# Altium project PCB_Project1.PrjPCB (part 2 of 2)

## Sheet Sheet7.SchDoc
size A4
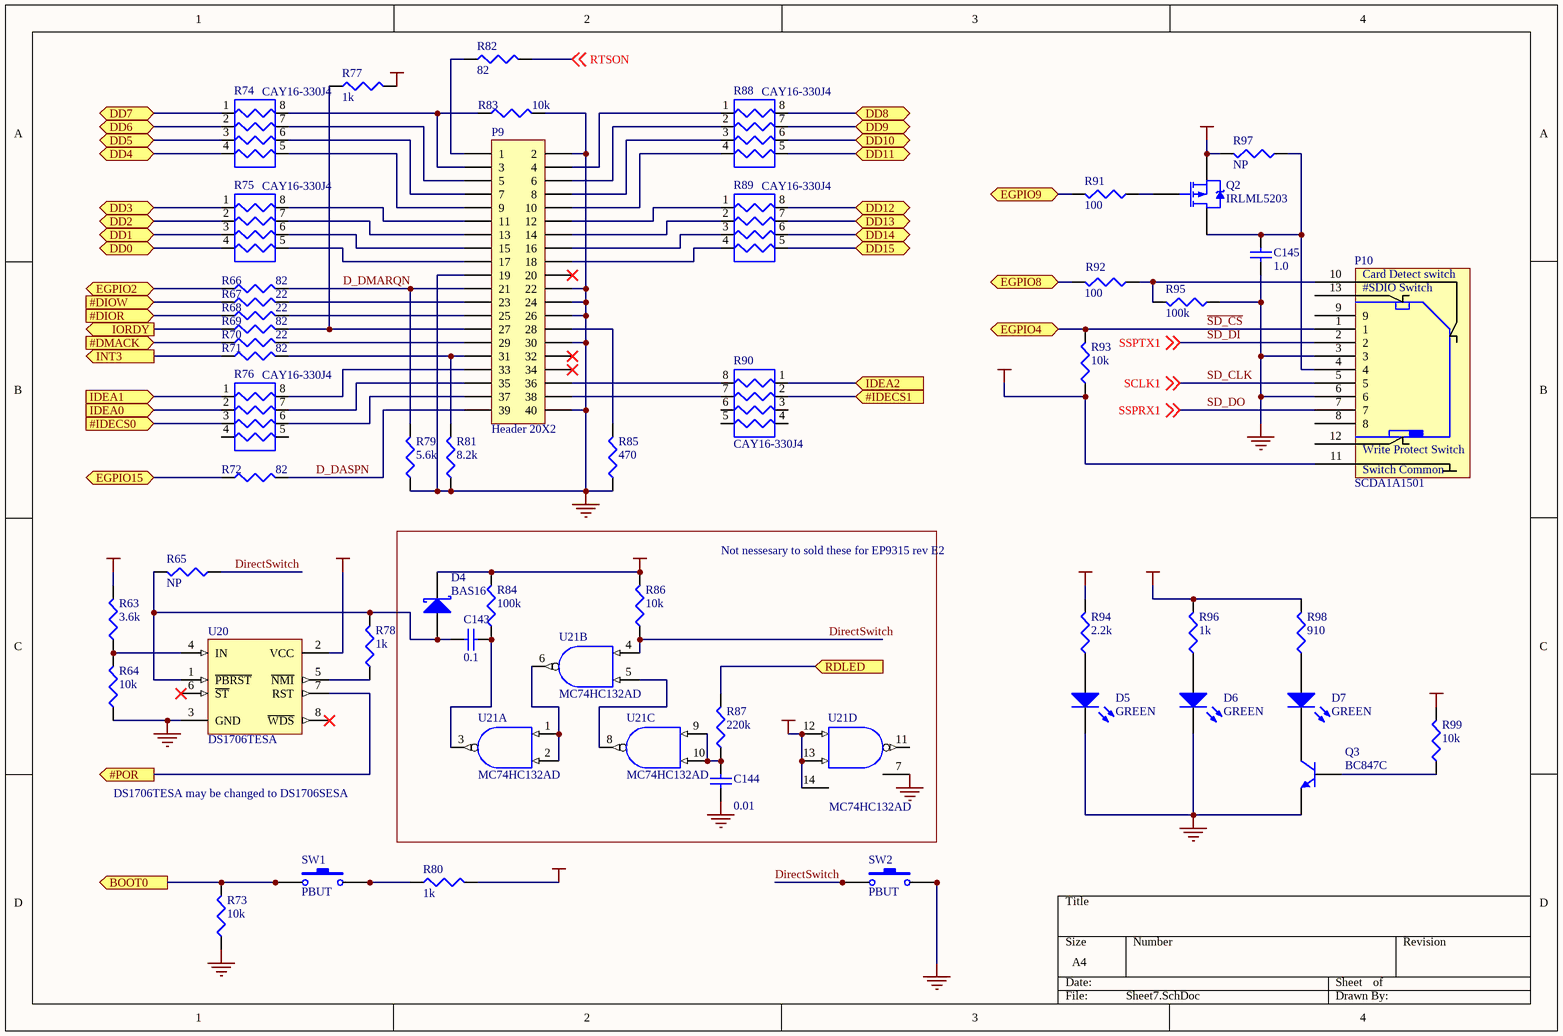
[diagram p6: Sheet7.SchDoc]

### Parts
C143  0.1  [0603]
C144  0.01  [0603]
C145  1.0  [0603]
D4  BAS16  [SOT23]
D5  GREEN  [DSO-F2/D6.1]
D6  GREEN  [DSO-F2/D6.1]
D7  GREEN  [DSO-F2/D6.1]
P9  Header 20X2  [HDR2X20]
P10  SCDA1A1501  [SCDA_NO2]
Q2  IRLML5203  [SOT-23]
Q3  BC847C  [SOT23]
R63  3.6k  [CR1608-0603]
R64  10k  [CR1608-0603]
R65  NP  [CR1608-0603]
R66  82  [CR1608-0603]
R67  22  [CR1608-0603]
R68  22  [CR1608-0603]
R69  82  [CR1608-0603]
R70  22  [CR1608-0603]
R71  82  [CR1608-0603]
R72  82  [CR1608-0603]
R73  10k  [CR1608-0603]
R74  CAY16-330J4  [CAY16-J4]
R75  CAY16-330J4  [CAY16-J4]
R76  CAY16-330J4  [CAY16-J4]
R77  1k  [CR1608-0603]
R78  1k  [CR1608-0603]
R79  5.6k  [CR1608-0603]
R80  1k  [CR1608-0603]
R81  8.2k  [CR1608-0603]
R82  82  [CR1608-0603]
R83  10k  [CR1608-0603]
R84  100k  [CR1608-0603]
R85  470  [CR1608-0603]
R86  10k  [CR1608-0603]
R87  220k  [CR1608-0603]
R88  CAY16-330J4  [CAY16-J4]
R89  CAY16-330J4  [CAY16-J4]
R90  CAY16-330J4  [CAY16-J4]
R91  100  [CR1608-0603]
R92  100  [CR1608-0603]
R93  10k  [CR1608-0603]
R94  2.2k  [CR1608-0603]
R95  100k  [CR1608-0603]
R96  1k  [CR1608-0603]
R97  NP  [CR1608-0603]
R98  910  [CR1608-0603]
R99  10k  [CR1608-0603]
SW1  PBUT  [SWBUTDIP4]
SW2  PBUT  [SWBUTDIP4]
U20  DS1706TESA  [SOIC8N]
U21  MC74HC132AD  [751A-03]  (parts A,B,C,D of 4)

### Blocks framed on the sheet
Not nessesary to sold these for EP9315 rev E2: C143 C144 D4 R84 R86 R87 U21

### Ports
#DIOR (in), #DIOW (in), #DMACK (in), #IDECS0 (in), #IDECS1 (in), #POR (out), BOOT0 (out), DD0 (bidir), DD1 (bidir), DD2 (bidir), DD3 (bidir), DD4 (bidir), DD5 (bidir), DD6 (bidir), DD7 (bidir), DD8 (bidir), DD9 (bidir), DD10 (bidir), DD11 (bidir), DD12 (bidir), DD13 (bidir), DD14 (bidir), DD15 (bidir), EGPIO2 (bidir), EGPIO4 (bidir), EGPIO8 (bidir), EGPIO9 (bidir), EGPIO15 (bidir), IDEA0 (in), IDEA1 (in), IDEA2 (in), INT3 (out), IORDY (out), RDLED (in)

### Nets
GND: C144.1 C145.1 D5.2(K) D6.2(K) P9.2 P9.19 P9.22 P9.24 P9.26 P9.30 P9.40 P10.3 P10.6 Q3.2(E) R64.1 R73.1 R79.1 R81.1 R83.2 R85.1 R95.1 SW2.2 SW2.3 U20.3(GND) U21.7(GND)
VCC5V0: R94.2
VCCCORE: R63.2 R99.2
VCCIO: D4.3(K) P10.11(common) Q2.2(S) R77.2 R80.2 R84.2 R86.2 R93.1 R96.2 R97.2 R98.2 U20.2(VCC) U21.12(A) U21.13(B) U21.14(VDD)  [also labelled VDD]
#POR: U20.7(RST) ; port #POR
BOOT0: R73.2 SW1.1 SW1.4 ; port BOOT0
D_DASPN: P9.39 R72.2
D_DMARQN: P9.21 R66.2 R79.2
DirectSwitch: R65.1 R86.1 SW2.1 SW2.4 U21.4(A)
INT3: R71.1 ; port INT3
RDLED: R87.2 ; port RDLED
RTSON: R82.2 ; off-sheet RTSON
~{SD_CS}: P10.1 R93.2 ; port EGPIO4
SCLK1: P10.5 ; off-sheet SCLK1  [also labelled SD_CLK]
SD_DI: P10.2 ; off-sheet SSPTX1  [also labelled SSPTX1]
SD_DO: P10.7 ; off-sheet SSPRX1  [also labelled SSPRX1]
NetC143_1: C143.1 R84.1 U21.3(Y)
NetC143_2: C143.2 D4.1(A) R65.2 R78.2 U20.1(~{PBRST})
NetC144_2: C144.2 R87.1 U21.9(A) U21.10(B)
NetC145_2: C145.2 P10.4 Q2.3(D) R97.1
NetD5_1: D5.1(A) R94.1
NetD6_1: D6.1(A) R96.1
NetD7_1: D7.1(A) R98.1
NetD7_2: D7.2(K) Q3.3(C)
NetP9_1: P9.1 R82.1
NetP9_3: P9.3 R74.8 R83.1
NetP9_4: P9.4 R88.1
NetP9_5: P9.5 R74.7
NetP9_6: P9.6 R88.2
NetP9_7: P9.7 R74.6
NetP9_8: P9.8 R88.3
NetP9_9: P9.9 R74.5
NetP9_10: P9.10 R88.4
NetP9_11: P9.11 R75.8
NetP9_12: P9.12 R89.1
NetP9_13: P9.13 R75.7
NetP9_14: P9.14 R89.2
NetP9_15: P9.15 R75.6
NetP9_16: P9.16 R89.3
NetP9_17: P9.17 R75.5
NetP9_18: P9.18 R89.4
NetP9_23: P9.23 R67.2
NetP9_25: P9.25 R68.2
NetP9_27: P9.27 R69.2 R77.1
NetP9_28: P9.28 R85.2
NetP9_29: P9.29 R70.2
NetP9_31: P9.31 R71.2 R81.2
NetP9_33: P9.33 R76.8
NetP9_35: P9.35 R76.7
NetP9_36: P9.36 R90.8
NetP9_37: P9.37 R76.6
NetP9_38: P9.38 R90.7
NetP10_10: P10.10(CDETECT) R92.1 R95.2
NetQ2_1: Q2.1(G) R91.1
NetQ3_1: Q3.1(B) R99.1
NetR63_1: R63.1 R64.2 U20.4(IN)
NetR66_1: R66.1 ; port EGPIO2
NetR67_1: R67.1 ; port #DIOW
NetR68_1: R68.1 ; port #DIOR
NetR69_1: R69.1 ; port IORDY
NetR70_1: R70.1 ; port #DMACK
NetR72_1: R72.1 ; port EGPIO15
NetR74_1: R74.1 ; port DD7
NetR74_2: R74.2 ; port DD6
NetR74_3: R74.3 ; port DD5
NetR74_4: R74.4 ; port DD4
NetR75_1: R75.1 ; port DD3
NetR75_2: R75.2 ; port DD2
NetR75_3: R75.3 ; port DD1
NetR75_4: R75.4 ; port DD0
NetR76_1: R76.1 ; port IDEA1
NetR76_2: R76.2 ; port IDEA0
NetR76_3: R76.3 ; port #IDECS0
NetR78_1: R78.1 U20.5(~{NMI})
NetR80_1: R80.1 SW1.2 SW1.3
NetR88_5: R88.5 ; port DD11
NetR88_6: R88.6 ; port DD10
NetR88_7: R88.7 ; port DD9
NetR88_8: R88.8 ; port DD8
NetR89_5: R89.5 ; port DD15
NetR89_6: R89.6 ; port DD14
NetR89_7: R89.7 ; port DD13
NetR89_8: R89.8 ; port DD12
NetR90_1: R90.1 ; port IDEA2
NetR90_2: R90.2 ; port #IDECS1
NetR91_2: R91.2 ; port EGPIO9
NetR92_2: R92.2 ; port EGPIO8
NetU21_1: U21.1(A) U21.2(B) U21.6(Y)
NetU21_5: U21.5(B) U21.8(Y)

Not connected (* = marked no-connect by the designer): P9 20* 32* 34*; P10 8 9 12(WP) 13(SDIO); R76 4 5; R90 3 4 5 6; U20 6(~{ST})* 8(~{WDS})*; U21 11(Y)

### Notes on the sheet
- DS1706TESA may be changed to DS1706SESA
- (in symbol SCDA1A1501) Card Detect switch; #SDIO Switch; Write Protect Switch; Switch Common

### Library data of the parts
C143-C145 = C0603: as C1 on sheet Sheet1; Published: 17-Jul-2002; LatestRevisionDate: 19-Mar-2004; LatestRevisionNote: Silkscreen size reduced.; DatasheetDocument: Mar-2001; PackageDocument: Mar-2001; PackageReference: 0603; Publisher: Altium Limited; Code_JEITA: 0603; Code_IPC: 1608 [0603]; ComponentLink1Description: Manufacturer Link; ComponentLink1URL: http://www.kemet.com/; ComponentLink2Description: Datasheet; ComponentLink2URL: http://www.kemet.com/kemet/web/homepage/kechome.nsf/vapubfilesname/F3102TA.pdf/$file/F3102TA.pdf
  C143: Value: 0.1
  C144: Value: 0.01
  C145: Value: 1.0
D4 = BAS40: Schottky Barrier Diode; Note: Pin 2 is not connected and is not drawn; Published: 17-Sep-2003; DatasheetDocument: 10-Feb-2001; PackageDocument: May-1999; PackageReference: SOT23; Publisher: Altium Limited; ComponentLink1Description: Manufacturer Link; ComponentLink1URL: http://www.semiconductors.philips.com/; ComponentLink2Description: Datasheet; ComponentLink2URL: http://www.semiconductors.philips.com/acrobat/datasheets/BAS40_SERIES_5.pdf
D5-D7 = LED2: Typical RED, GREEN, YELLOW, AMBER GaAs LED; Published: 8-Jun-2000; Revision: July-2002: Re-released for DXP Platform.; Publisher: Altium Limited
P9 = Header 20X2: Header, 20-Pin, Dual row; LatestRevisionDate: 17-Jul-2002; LatestRevisionNote: Re-released for DXP Platform.; Publisher: Altium Limited
P10 = SCDA1A1501: Connector for SD Memory Card
Q2 = IRLML5103: HEXFET Power MOSFET; Published: 8-Jun-2000; LatestRevisionDate: 17-Jul-2002; LatestRevisionNote: Re-released for DXP Platform.; DatasheetDocument: Aug-1997; PackageReference: SOT-23; Publisher: Altium Limited; ComponentLink1Description: Manufacturer Link; ComponentLink1URL: http://www.irf.com/
Q3 = BC847C: NPN General-purpose Transistor; Published: 17-Sep-2003; DatasheetDocument: 4-Feb-2002; PackageDocument: May-1999; PackageReference: SOT23; Publisher: Altium Limited; ComponentLink1Description: Manufacturer Link; ComponentLink1URL: http://www.semiconductors.philips.com/; ComponentLink2Description: Datasheet; ComponentLink2URL: http://www.semiconductors.philips.com/acrobat/datasheets/BC846_BC847_BC848_5.pdf
R63-R73 R77-R87 R91-R99 = Res3: Resistor; Published: 8-Jun-2000; Revision: July-2002: Re-released for DXP Platform.; Publisher: Altium Limited
  R63: Value: 3.6k
  R64 R73 R83 R86 R93 R99: Value: 10k
  R65 R97: Value: NP
  R66 R69 R71 R72 R82: Value: 82
  R67 R68 R70: Value: 22
  R77 R78 R80 R96: Value: 1k
  R79: Value: 5.6k
  R81: Value: 8.2k
  R84 R95: Value: 100k
  R85: Value: 470
  R87: Value: 220k
  R91 R92: Value: 100
  R94: Value: 2.2k
  R98: Value: 910
R74-R76 R88-R90 = CAY16-J4: Chip Resistor Arrays
SW1 SW2 = PBUT: DIP4 PushButton
U20 = DS1706LESA: 3.3 and 5.0 Volt MicroMonitor; PackageDocument: 1999; Published: 13-Oct-2000; LatestRevisionDate: 4-Mar-2005; LatestRevisionNote: Stylized 3D Model Added.; DatasheetDocument: 4-Sep-1998; PackageReference: SOIC8N; Publisher: Altium Limited; ComponentLink1Description: Manufacturer Link; ComponentLink1URL: http://www.maxim-ic.com/
U21 = MC74HC132AD: Quad 2-Input NAND Gate with Schmitt Trigger Inputs; Published: 15-Apr-2002; DatasheetDocument: Mar-2000; PackageReference: 751A-03; Publisher: Altium Limited; Code_JEDEC: MS-012-AB; Code_IPC: SO14; ComponentLink1Description: Manufacturer Link; ComponentLink1URL: http://www.onsemi.com/

## Sheet Sheet8.SchDoc
size A4
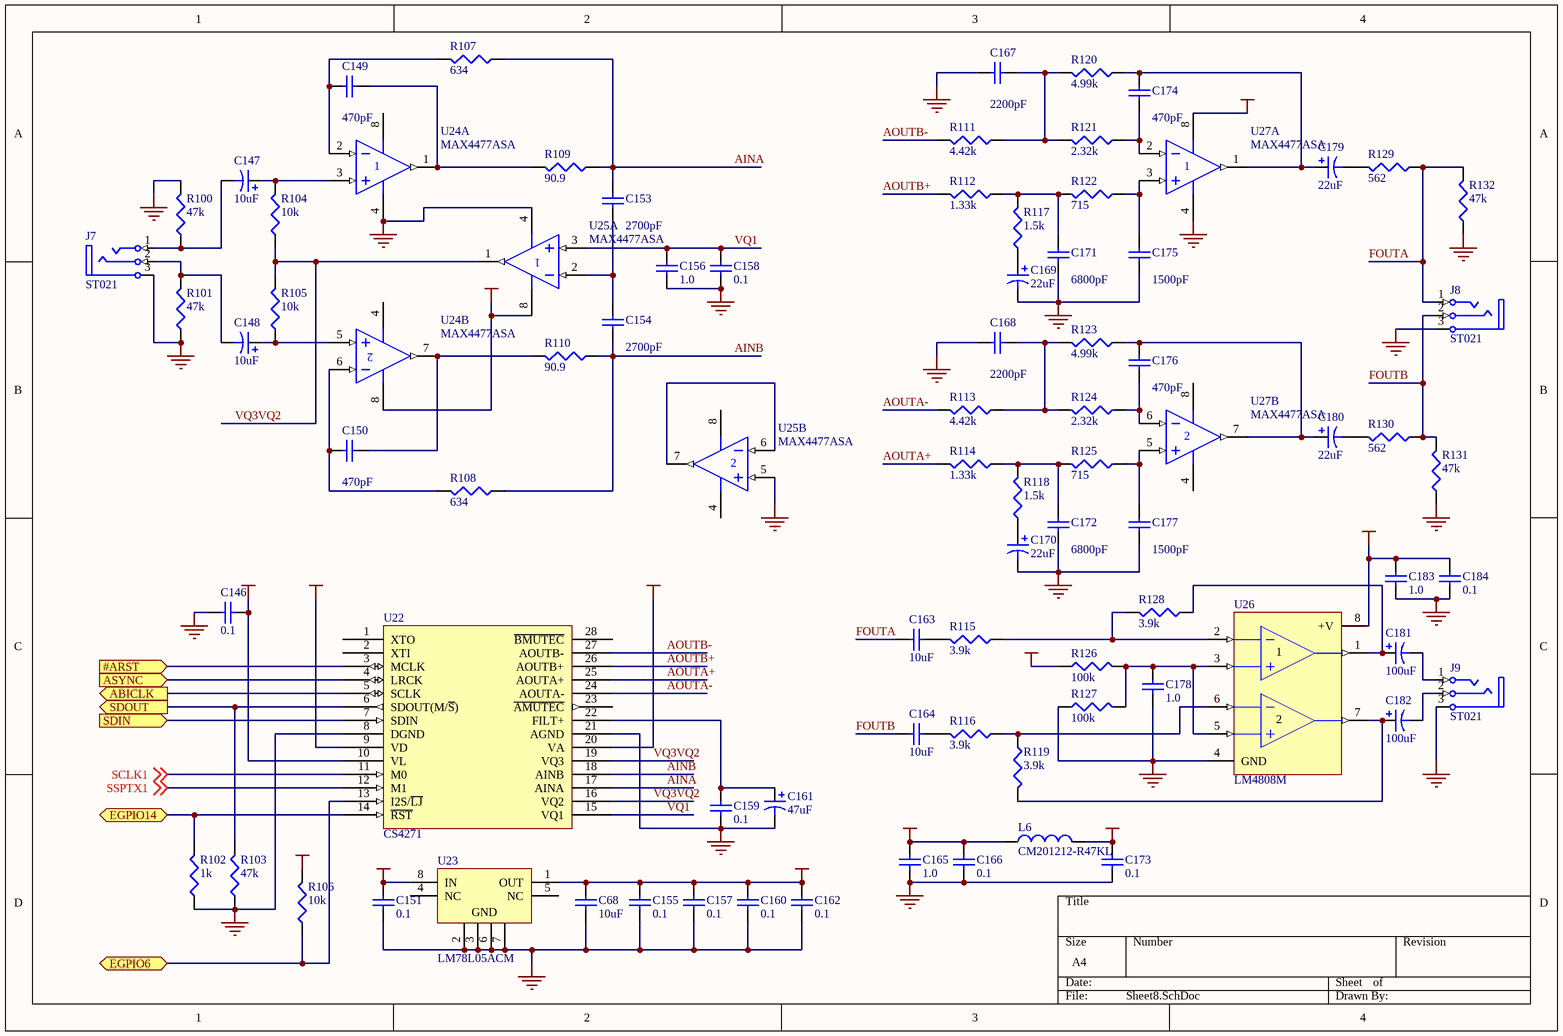
[diagram p7: Sheet8.SchDoc]

### Parts
C68  10uF  [1206]
C146  0.1  [0603]
C147  10uF  [CAPPR1.5-4x5]
C148  10uF  [CAPPR1.5-4x5]
C149  470pF  [0603]
C150  470pF  [0603]
C151  0.1  [0603]
C153  2700pF  [0603]
C154  2700pF  [0603]
C155  0.1  [0603]
C156  1.0  [0603]
C157  0.1  [0603]
C158  0.1  [0603]
C159  0.1  [0603]
C160  0.1  [0603]
C161  47uF  [CAPPR1.5-4x5]
C162  0.1  [0603]
C163  10uF  [1206]
C164  10uF  [1206]
C165  1.0  [0603]
C166  0.1  [0603]
C167  2200pF  [0603]
C168  2200pF  [0603]
C169  22uF  [CAPPR1.5-4x5]
C170  22uF  [CAPPR1.5-4x5]
C171  6800pF  [0603]
C172  6800pF  [0603]
C173  0.1  [0603]
C174  470pF  [0603]
C175  1500pF  [0603]
C176  470pF  [0603]
C177  1500pF  [0603]
C178  1.0  [0603]
C179  22uF  [CAPPR1.5-4x5]
C180  22uF  [CAPPR1.5-4x5]
C181  100uF  [CAPPR1.5-4x5]
C182  100uF  [CAPPR1.5-4x5]
C183  1.0  [0603]
C184  0.1  [0603]
J7  ST021  [ST023]
J8  ST021  [ST023]
J9  ST021  [ST023]
L6  CM201212-R47KL  [INDC2012-0805]
R100  47k  [CR1608-0603]
R101  47k  [CR1608-0603]
R102  1k  [CR1608-0603]
R103  47k  [CR1608-0603]
R104  10k  [CR1608-0603]
R105  10k  [CR1608-0603]
R106  10k  [CR1608-0603]
R107  634  [CR1608-0603]
R108  634  [CR1608-0603]
R109  90.9  [CR1608-0603]
R110  90.9  [CR1608-0603]
R111  4.42k  [CR1608-0603]
R112  1.33k  [CR1608-0603]
R113  4.42k  [CR1608-0603]
R114  1.33k  [CR1608-0603]
R115  3.9k  [CR1608-0603]
R116  3.9k  [CR1608-0603]
R117  1.5k  [CR1608-0603]
R118  1.5k  [CR1608-0603]
R119  3.9k  [CR1608-0603]
R120  4.99k  [CR1608-0603]
R121  2.32k  [CR1608-0603]
R122  715  [CR1608-0603]
R123  4.99k  [CR1608-0603]
R124  2.32k  [CR1608-0603]
R125  715  [CR1608-0603]
R126  100k  [CR1608-0603]
R127  100k  [CR1608-0603]
R128  3.9k  [CR1608-0603]
R129  562  [CR1608-0603]
R130  562  [CR1608-0603]
R131  47k  [CR1608-0603]
R132  47k  [CR1608-0603]
U22  CS4271  [TSOP28]
U23  LM78L05ACM  [M08A]
U24  MAX4477ASA  [NSO8]  (parts A,B of 2)
U25  MAX4477ASA  [NSO8]  (parts A,B of 2)
U26  LM4808M  [M08A]
U27  MAX4477ASA  [NSO8]  (parts A,B of 2)

### Ports
#ARST (in), ABICLK (out), ASYNC (in), EGPIO6 (bidir), EGPIO14 (bidir), SDIN (in), SDOUT (out)

### Nets
GND: C68.1 C146.1 C151.2 C155.2 C156.1 C157.2 C158.1 C159.2 C160.2 C161.2 C162.2 C165.1 C166.2 C167.2 C168.2 C169.2 C170.2 C171.1 C172.1 C173.2 C175.1 C177.1 C178.1 C183.1 C184.2 J7.3(S) J8.3(S) J9.3(S) R100.2 R101.1 R102.1 R103.1 R127.1 R131.1 R132.1 U22.8(DGND) U22.21(AGND) U23.2(GND) U23.3(GND) U23.6(GND) U23.7(GND) U24.4(VEE) U25.4(VEE) U25.5(IN+) U26.4(GND) U27.4(VEE)
VCC5V0: C173.1 L6.2
VCC12: C151.1 U23.8(IN)
VCC_5V0_AD: C68.2 C155.1 C157.1 C160.1 C162.1 C183.2 C184.1 R126.1 U22.20(VA) U23.1(OUT) U24.8(VCC) U25.8(VCC) U26.8(+V) U27.8(VCC)
VCC_5V0_I2S: C165.2 C166.1 L6.1 U22.9(VD)
VCCIO: C146.2 R106.2 U22.10(VL)
AINA: C153.2 R107.1 R109.1 U22.17(AINA)
AINB: C154.1 R108.1 R110.1 U22.18(AINB)
AOUTA+: R114.2 U22.25(AOUTA+)
AOUTA-: R113.2 U22.24(AOUTA-)
AOUTB+: R112.2 U22.26(AOUTB+)
AOUTB-: R111.2 U22.27(AOUTB-)
FOUTA: C163.2 J8.1(T) R129.1 R132.2
FOUTB: C164.2 J8.2(R) R130.1 R131.2
SCLK1: U22.11(M0) ; off-sheet SCLK1
SDIN: U22.7(SDIN) ; port SDIN
SSPTX1: U22.12(M1) ; off-sheet SSPTX1  [project net SD_DI]
VQ1: C156.2 C158.2 U22.15(VQ1) U25.3(IN+)
VQ3VQ2: R104.1 R105.2 U22.16(VQ2) U22.19(VQ3) U25.1(OUT)
NetC147_1: C147.1 R104.2 U24.3(IN+)
NetC147_2: C147.2 J7.1(T) R100.1
NetC148_1: C148.1 R105.1 U24.5(IN+)
NetC148_2: C148.2 J7.2(R) R101.2
NetC149_1: C149.1 R107.2 U24.2(IN-)
NetC149_2: C149.2 R109.2 U24.1(OUT)
NetC150_1: C150.1 R108.2 U24.6(IN-)
NetC150_2: C150.2 R110.2 U24.7(OUT)
NetC153_1: C153.1 C154.2 U25.2(IN-)
NetC159_1: C159.1 C161.1 U22.22(FILT+)
NetC163_1: C163.1 R115.2
NetC164_1: C164.1 R116.2
NetC167_1: C167.1 R111.1 R120.2 R121.2
NetC168_1: C168.1 R113.1 R123.2 R124.2
NetC169_1: C169.1 R117.1
NetC170_1: C170.1 R118.1
NetC171_2: C171.2 R112.1 R117.2 R122.2
NetC172_2: C172.2 R114.1 R118.2 R125.2
NetC174_1: C174.1 R121.1 U27.2(IN-)
NetC174_2: C174.2 C179.1 R120.1 U27.1(OUT)
NetC175_2: C175.2 R122.1 U27.3(IN+)
NetC176_1: C176.1 R124.1 U27.6(IN-)
NetC176_2: C176.2 C180.1 R123.1 U27.7(OUT)
NetC177_2: C177.2 R125.1 U27.5(IN+)
NetC178_2: C178.2 R126.2 R127.2 U26.3(IN+) U26.5(IN+)
NetC179_2: C179.2 R129.2
NetC180_2: C180.2 R130.2
NetC181_1: C181.1 R128.1 U26.1(OUT)
NetC181_2: C181.2 J9.1(T)
NetC182_1: C182.1 R119.2 U26.7(OUT)
NetC182_2: C182.2 J9.2(R)
NetR102_2: R102.2 U22.14(~{RST}) ; port EGPIO14
NetR103_2: R103.2 U22.6(SDOUT(M/~{S})) ; port SDOUT
NetR106_1: R106.1 U22.13(I2S/~{LJ}) ; port EGPIO6
NetR115_1: R115.1 R128.2 U26.2(IN-)
NetR116_1: R116.1 R119.1 U26.6(IN-)
NetU2_D18: U22.3(MCLK) ; port #ARST
NetU2_V14: U22.4(LRCK) ; port ASYNC
NetU2_Y20: U22.5(SCLK) ; port ABICLK
NetU25_6: U25.6(IN-) U25.7(OUT)

Not connected (* = marked no-connect by the designer): U22 1(XTO) 2(XTI) 23(~{AMUTEC}) 28(~{BMUTEC}); U23 4(NC) 5(NC)

### Library data of the parts
C68 C163 C164 = C1206: Ceramic Chip Capacitor - Standard; Published: 17-Jul-2002; LatestRevisionDate: 19-Mar-2004; LatestRevisionNote: Silkscreen size reduced.; DatasheetDocument: Mar-2001; PackageDocument: Mar-2001; PackageReference: 1206; Publisher: Altium Limited; Code_JEITA: 1206; Code_IPC: 3216 [1206]; ComponentLink1Description: Manufacturer Link; ComponentLink1URL: http://www.kemet.com/; ComponentLink2Description: Datasheet; ComponentLink2URL: http://www.kemet.com/kemet/web/homepage/kechome.nsf/vapubfilesname/F3102TA.pdf/$file/F3102TA.pdf; Value: 10uF
C146 C149-C151 C153-C160 C162 C165-C168 C171-C178 C183 C184 = C0603: as C1 on sheet Sheet1; Published: 17-Jul-2002; LatestRevisionDate: 19-Mar-2004; LatestRevisionNote: Silkscreen size reduced.; DatasheetDocument: Mar-2001; PackageDocument: Mar-2001; PackageReference: 0603; Publisher: Altium Limited; Code_JEITA: 0603; Code_IPC: 1608 [0603]; ComponentLink1Description: Manufacturer Link; ComponentLink1URL: http://www.kemet.com/; ComponentLink2Description: Datasheet; ComponentLink2URL: http://www.kemet.com/kemet/web/homepage/kechome.nsf/vapubfilesname/F3102TA.pdf/$file/F3102TA.pdf
  C146 C151 C155 C157-C160 C162 C166 C173 C184: Value: 0.1
  C149 C150 C174 C176: Value: 470pF
  C153 C154: Value: 2700pF
  C156 C165 C178 C183: Value: 1.0
  C167 C168: Value: 2200pF
  C171 C172: Value: 6800pF
  C175 C177: Value: 1500pF
C147 C148 C161 C169 C170 C179-C182 = Cap Pol1: Polarized Capacitor (Radial); Published: 8-Jun-2000; LatestRevisionDate: 17-Jul-2002; LatestRevisionNote: Re-released for DXP Platform.; Publisher: Altium Limited
J7-J9 = PhoneJack: 3.5" jack
L6 = Inductor: Published: 8-Jun-2000; Revision: July-2002: Re-released for DXP Platform.; Publisher: Altium Limited; Value: CM201212-R47KL
R100-R132 = Res3: Resistor; Published: 8-Jun-2000; Revision: July-2002: Re-released for DXP Platform.; Publisher: Altium Limited
  R100 R101 R103 R131 R132: Value: 47k
  R102: Value: 1k
  R104-R106: Value: 10k
  R107 R108: Value: 634
  R109 R110: Value: 90.9
  R111 R113: Value: 4.42k
  R112 R114: Value: 1.33k
  R115 R116 R119 R128: Value: 3.9k
  R117 R118: Value: 1.5k
  R120 R123: Value: 4.99k
  R121 R124: Value: 2.32k
  R122 R125: Value: 715
  R126 R127: Value: 100k
  R129 R130: Value: 562
U22 = CS4271: 24-Bit, 192 kHz Stereo Audio CODEC
U23 = LM78L05ACM: 3-Terminal Positive Regulator; Published: 15-Apr-2002; LatestRevisionDate: 6-Jun-2005; LatestRevisionNote: Stylized 3D Model Added.; DatasheetDocument: Sep-1999; PackageDocument: Sep-1997; PackageReference: M08A; Publisher: Altium Limited; Code_JEDEC: MS-012-AA; Code_IPC: SO8; ComponentLink1Description: Manufacturer Link; ComponentLink1URL: http://www.national.com/
U24 U25 U27 = MAX4242ESA: Dual, +1.8V/10µA, SOT23, Beyond-the-Rails Op Amp; Published: 23-Sep-2002; LatestRevisionDate: 6-Jun-2005; LatestRevisionNote: Stylized 3D Model Added.; DatasheetDocument: Rev 0; 3/98; PackageReference: NSO8; Publisher: Altium Limited; Code_JEDEC: MS-012-AA; Code_IPC: SO8; ComponentLink1Description: Manufacturer Link; ComponentLink1URL: http://www.maxim-ic.com/; ComponentLink2Description: Datasheet; ComponentLink2URL: http://pdfserv.maxim-ic.com/en/ds/MAX4240-MAX4244.pdf
U26 = LM4808M: Dual 105 mW Headphone Amplifier

## Sheet Sheet9.SchDoc
size A4
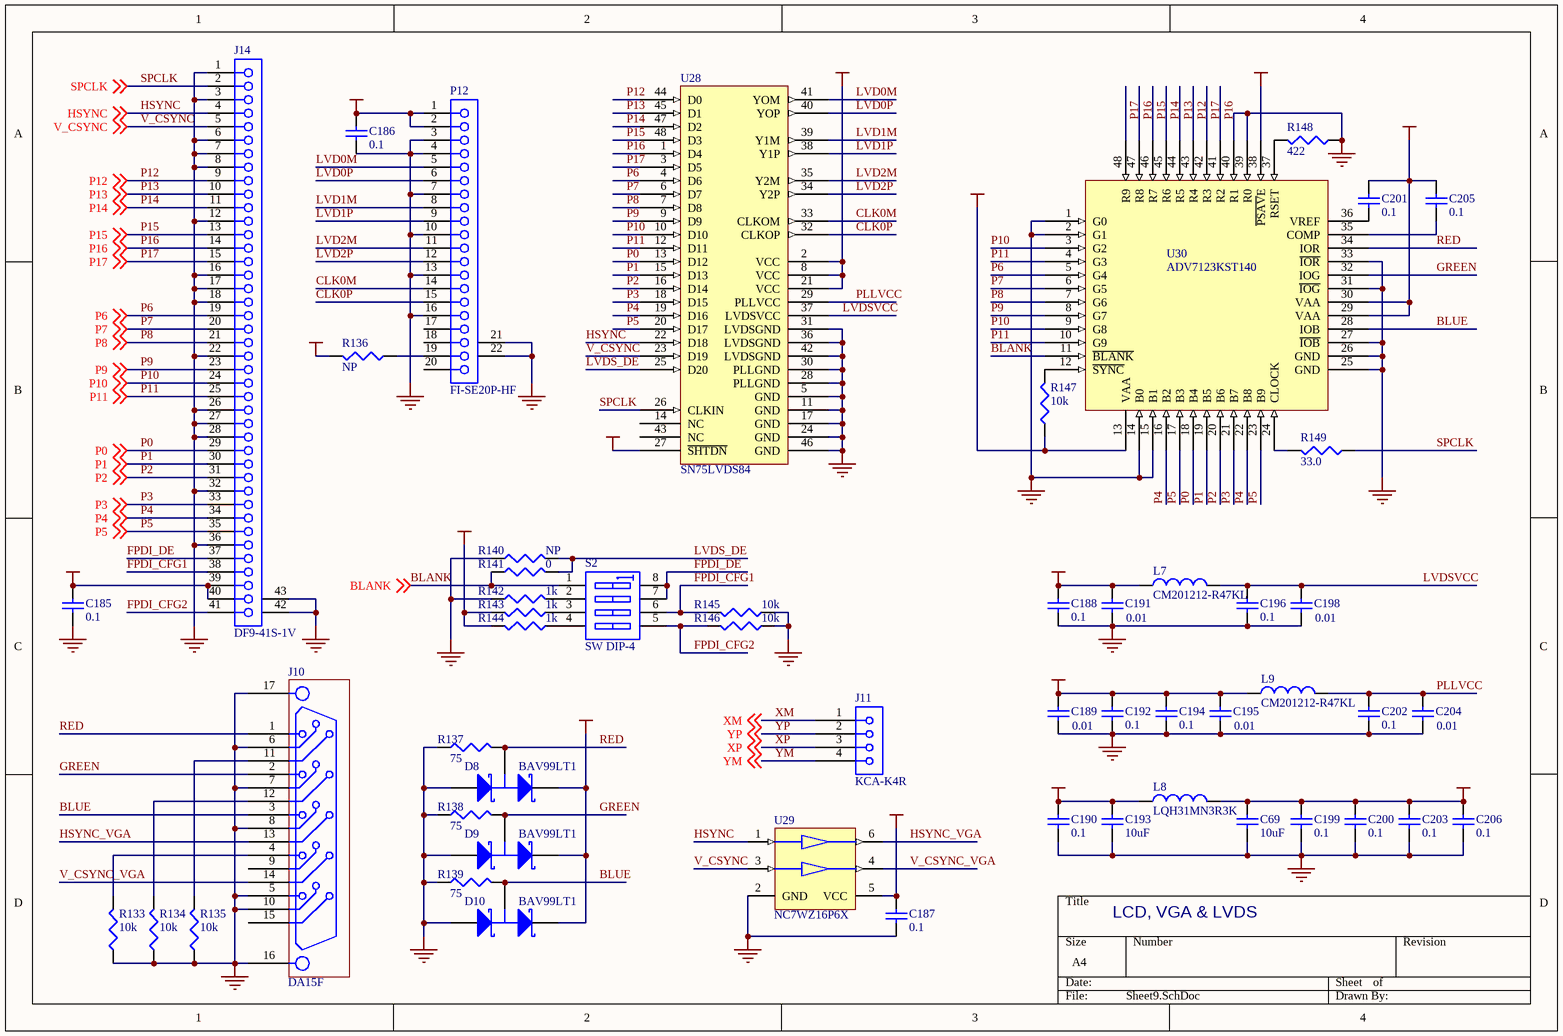
[diagram p8: Sheet9.SchDoc]

### Parts
C69  10uF  [1206]
C185  0.1  [0603]
C186  0.1  [0603]
C187  0.1  [0603]
C188  0.1  [0603]
C189  0.01  [0603]
C190  0.1  [0603]
C191  0.01  [0603]
C192  0.1  [0603]
C193  10uF  [1206]
C194  0.1  [0603]
C195  0.01  [0603]
C196  0.1  [0603]
C198  0.01  [0603]
C199  0.1  [0603]
C200  0.1  [0603]
C201  0.1  [0603]
C202  0.1  [0603]
C203  0.1  [0603]
C204  0.01  [0603]
C205  0.1  [0603]
C206  0.1  [0603]
D8  BAV99LT1  [SOT23]
D9  BAV99LT1  [SOT23]
D10  BAV99LT1  [SOT23]
J10  DA15F  [DA15F]
J11  KCA-K4R  [KCAK4R]
J14  DF9-41S-1V  [DF9-41S-1V]
L7  CM201212-R47KL  [INDC2012-0805]
L8  LQH31MN3R3K  [INDC3216-1206]
L9  CM201212-R47KL  [INDC2012-0805]
P12  FI-SE20P-HF  [FI-SE20P-HF]
R133  10k  [CR1608-0603]
R134  10k  [CR1608-0603]
R135  10k  [CR1608-0603]
R136  NP  [CR1608-0603]
R137  75  [CR1608-0603]
R138  75  [CR1608-0603]
R139  75  [CR1608-0603]
R140  NP  [CR1608-0603]
R141  0  [CR1608-0603]
R142  1k  [CR1608-0603]
R143  1k  [CR1608-0603]
R144  1k  [CR1608-0603]
R145  10k  [CR1608-0603]
R146  10k  [CR1608-0603]
R147  10k  [CR1608-0603]
R148  422  [CR1608-0603]
R149  value 33.0  [CR1608-0603]  (hidden comment: 33)
S2  SW DIP-4  [SO-G8/D6.6]
U28  SN75LVDS84  [TSSO12x8-48]
U29  NC7WZ16P6X  [SC88]
U30  ADV7123KST140  [48A]

### Nets
GND: C69.1 C185.2 C186.2 C187.2 C188.2 C189.1 C190.2 C191.1 C192.2 C193.1 C194.2 C195.1 C196.2 C198.1 C199.2 C200.2 C202.2 C203.2 C204.1 C206.2 D8.1(A) D9.1(A) D10.1(A) J10.5 J10.6 J10.7 J10.8 J10.10 J10.16 J10.17 J14.1 J14.3 J14.6 J14.7 J14.8 J14.12 J14.16 J14.17 J14.18 J14.22 J14.26 J14.27 J14.28 J14.32 J14.36 J14.42(MH2) J14.43(MH1) P12.3 P12.4 P12.7 P12.10 P12.13 P12.16 P12.21 P12.22 R133.1 R134.1 R135.1 R137.1 R138.1 R139.1 R140.1 R142.1 R145.1 R146.1 R148.1 U28.5(GND) U28.11(GND) U28.17(GND) U28.24(GND) U28.28(PLLGND) U28.30(PLLGND) U28.31(LVDSGND) U28.36(LVDSGND) U28.42(LVDSGND) U28.46(GND) U29.2(GND) U30.1(G0) U30.2(G1) U30.14(B0) U30.15(B1) U30.25(GND) U30.26(GND) U30.27(~{IOB}) U30.31(~{IOG}) U30.33(~{IOR}) U30.39(R0) U30.40(R1)
VCC5V0: C190.1 C193.2 L8.1
VCC5V0_VGA: C69.2 C187.1 C199.1 C200.1 C201.1 C203.1 C205.1 C206.1 D8.2(K) D9.2(K) D10.2(K) L8.2 R147.1 U29.5(VCC) U30.13(VAA) U30.29(VAA) U30.30(VAA) U30.38(~{PSAV}E)
VCCIO: C185.1 C186.1 C188.1 C189.2 C191.2 C192.1 C194.1 C195.2 J14.39 J14.40 L7.1 L9.1 P12.1 P12.2 R136.2 R143.2 R144.2 U28.2(VCC) U28.8(VCC) U28.21(VCC) U28.27(~{SHTDN})
BLANK: R141.1 S2.1(A1) U30.11(~{BLANK}) ; off-sheet BLANK
BLUE: D10.3(C) J10.3 R139.2 U30.28(IOB)
CLK0M: P12.14 U28.33(CLKOM)
CLK0P: P12.15 U28.32(CLKOP)
FPDI_CFG1: J14.38 R145.2 S2.6(B3)
FPDI_CFG2: J14.41 R146.2 S2.5(B4)
FPDI_DE: J14.37 S2.7(B2) S2.8(B1)
GREEN: D9.3(C) J10.2 R138.2 U30.32(IOG)
HSYNC: J14.4 U28.22(D18) U29.1(A) ; off-sheet HSYNC
HSYNC_VGA: J10.13 U29.6(Y)
LVD0M: P12.5 U28.41(YOM)
LVD0P: P12.6 U28.40(YOP)
LVD1M: P12.8 U28.39(Y1M)
LVD1P: P12.9 U28.38(Y1P)
LVD2M: P12.11 U28.35(Y2M)
LVD2P: P12.12 U28.34(Y2P)
LVDS_DE: R140.2 R141.2 U28.25(D20)
LVDSVCC: C196.1 C198.2 L7.2 U28.37(LVDSVCC)
P0: J14.29 U28.13(D12) U30.18(B4) ; off-sheet P0
P1: J14.30 U28.15(D13) U30.19(B5) ; off-sheet P1
P2: J14.31 U28.16(D14) U30.20(B6) ; off-sheet P2
P3: J14.33 U28.18(D15) U30.21(B7) ; off-sheet P3
P4: J14.34 U28.19(D16) U30.16(B2) U30.22(B8) ; off-sheet P4
P5: J14.35 U28.20(D17) U30.17(B3) U30.23(B9) ; off-sheet P5
P6: J14.19 U28.4(D6) U30.5(G4) ; off-sheet P6
P7: J14.20 U28.6(D7) U30.6(G5) ; off-sheet P7
P8: J14.21 U28.7(D8) U30.7(G6) ; off-sheet P8
P9: J14.23 U28.9(D9) U30.8(G7) ; off-sheet P9
P10: J14.24 U28.10(D10) U30.3(G2) U30.9(G8) ; off-sheet P10
P11: J14.25 U28.12(D11) U30.4(G3) U30.10(G9) ; off-sheet P11
P12: J14.9 U28.44(D0) U30.43(R4) ; off-sheet P12
P13: J14.10 U28.45(D1) U30.44(R5) ; off-sheet P13
P14: J14.11 U28.47(D2) U30.45(R6) ; off-sheet P14
P15: J14.13 U28.48(D3) U30.46(R7) ; off-sheet P15
P16: J14.14 U28.1(D4) U30.41(R2) U30.47(R8) ; off-sheet P16
P17: J14.15 U28.3(D5) U30.42(R3) U30.48(R9) ; off-sheet P17
PLLVCC: C202.1 C204.2 L9.2 U28.29(PLLVCC)
RED: D8.3(C) J10.1 R137.2 U30.34(IOR)
SPCLK: J14.2 R149.1 U28.26(CLKIN) ; off-sheet SPCLK
V_CSYNC: J14.5 U28.23(D19) U29.3(B) ; off-sheet V_CSYNC
V_CSYNC_VGA: J10.14 U29.4(Y)
XM: J11.1 ; off-sheet XM
XP: J11.3 ; off-sheet XP
YM: J11.4 ; off-sheet YM
YP: J11.2 ; off-sheet YP
NetC201_2: C201.2 U30.36(VREF)
NetC205_2: C205.2 U30.35(COMP)
NetJ10_4: J10.4 R133.2
NetJ10_11: J10.11 R135.2
NetJ10_12: J10.12 R134.2
NetP12_19: P12.19 R136.1
NetR142_2: R142.2 S2.2(A2)
NetR143_1: R143.1 S2.3(A3)
NetR144_1: R144.1 S2.4(A4)
NetR147_2: R147.2 U30.12(~{SYNC})
NetR148_2: R148.2 U30.37(RSET)
NetR149_2: R149.2 U30.24(CLOCK)

Not connected (* = marked no-connect by the designer): J10 9 15; P12 17 18 20; U28 14(NC) 43(NC)

### Notes on the sheet
- LCD, VGA & LVDS

### Library data of the parts
C69 C193 = C1206: Ceramic Chip Capacitor - Standard; Published: 17-Jul-2002; LatestRevisionDate: 19-Mar-2004; LatestRevisionNote: Silkscreen size reduced.; DatasheetDocument: Mar-2001; PackageDocument: Mar-2001; PackageReference: 1206; Publisher: Altium Limited; Code_JEITA: 1206; Code_IPC: 3216 [1206]; ComponentLink1Description: Manufacturer Link; ComponentLink1URL: http://www.kemet.com/; ComponentLink2Description: Datasheet; ComponentLink2URL: http://www.kemet.com/kemet/web/homepage/kechome.nsf/vapubfilesname/F3102TA.pdf/$file/F3102TA.pdf; Value: 10uF
C185-C192 C194-C196 C198-C206 = C0603: Ceramic Chip Capacitor - Standard; Note: Footprint corresponds to dimensions for bulk cassette packaging. This case size has tightened tolerances.; Published: 17-Jul-2002; LatestRevisionDate: 19-Mar-2004; LatestRevisionNote: Silkscreen size reduced.; DatasheetDocument: Mar-2001; PackageDocument: Mar-2001; PackageReference: 0603; Publisher: Altium Limited; Code_JEITA: 0603; Code_IPC: 1608 [0603]; ComponentLink1Description: Manufacturer Link; ComponentLink1URL: http://www.kemet.com/; ComponentLink2Description: Datasheet; ComponentLink2URL: http://www.kemet.com/kemet/web/homepage/kechome.nsf/vapubfilesname/F3102TA.pdf/$file/F3102TA.pdf
  C185-C188 C190 C192 C194 C196 C199-C203 C205 C206: Value: 0.1
  C189 C191 C195 C198 C204: Value: 0.01
D8-D10 = BAS40-04: Schottky Barrier Double Diode; Published: 17-Sep-2003; DatasheetDocument: 10-Feb-2001; PackageDocument: May-1999; PackageReference: SOT23; Publisher: Altium Limited; ComponentLink1Description: Manufacturer Link; ComponentLink1URL: http://www.semiconductors.philips.com/; ComponentLink2Description: Datasheet; ComponentLink2URL: http://www.semiconductors.philips.com/acrobat/datasheets/BAS40_SERIES_5.pdf
J10 = DA15F: 15pin DSUB High Density Female
J11 = KCAK4R: Connector for ASTTouch Screen
J14 = DF9-41S-1V: 1mm Pitch SMT VESA FPDI-1
L7-L9 = Inductor: Published: 8-Jun-2000; Revision: July-2002: Re-released for DXP Platform.; Publisher: Altium Limited
  L7 L9: Value: CM201212-R47KL
  L8: Value: LQH31MN3R3K
P12 = FI-SE20P-HF: 20PIN 1.25mm pitch
R133-R149 = Res3: Resistor; Published: 8-Jun-2000; Revision: July-2002: Re-released for DXP Platform.; Publisher: Altium Limited
  R133-R135 R145-R147: Value: 10k
  R136 R140: Value: NP
  R137-R139: Value: 75
  R141: Value: 0
  R142-R144: Value: 1k
  R148: Value: 422
S2 = SW DIP-4: DIP Switch, 4 Position, SPST; Published: 24-Mar-1999; LatestRevisionDate: 17-Jul-2002; LatestRevisionNote: Re-released for DXP Platform.; Publisher: Altium Limited; Code_JEDEC: MS-012-AA; Code_IPC: SO8
U28 = SN75LVDS84: LVDS 18-Bit Color Flat Panel Display (FPD) Link
U29 = NC7WZ16P6X: TinyLogic UHS Dual Buffer
U30 = ADV7123: Triple 10-Bit High Speed Video DAC

## Sheet Sheet10.SchDoc
size A4
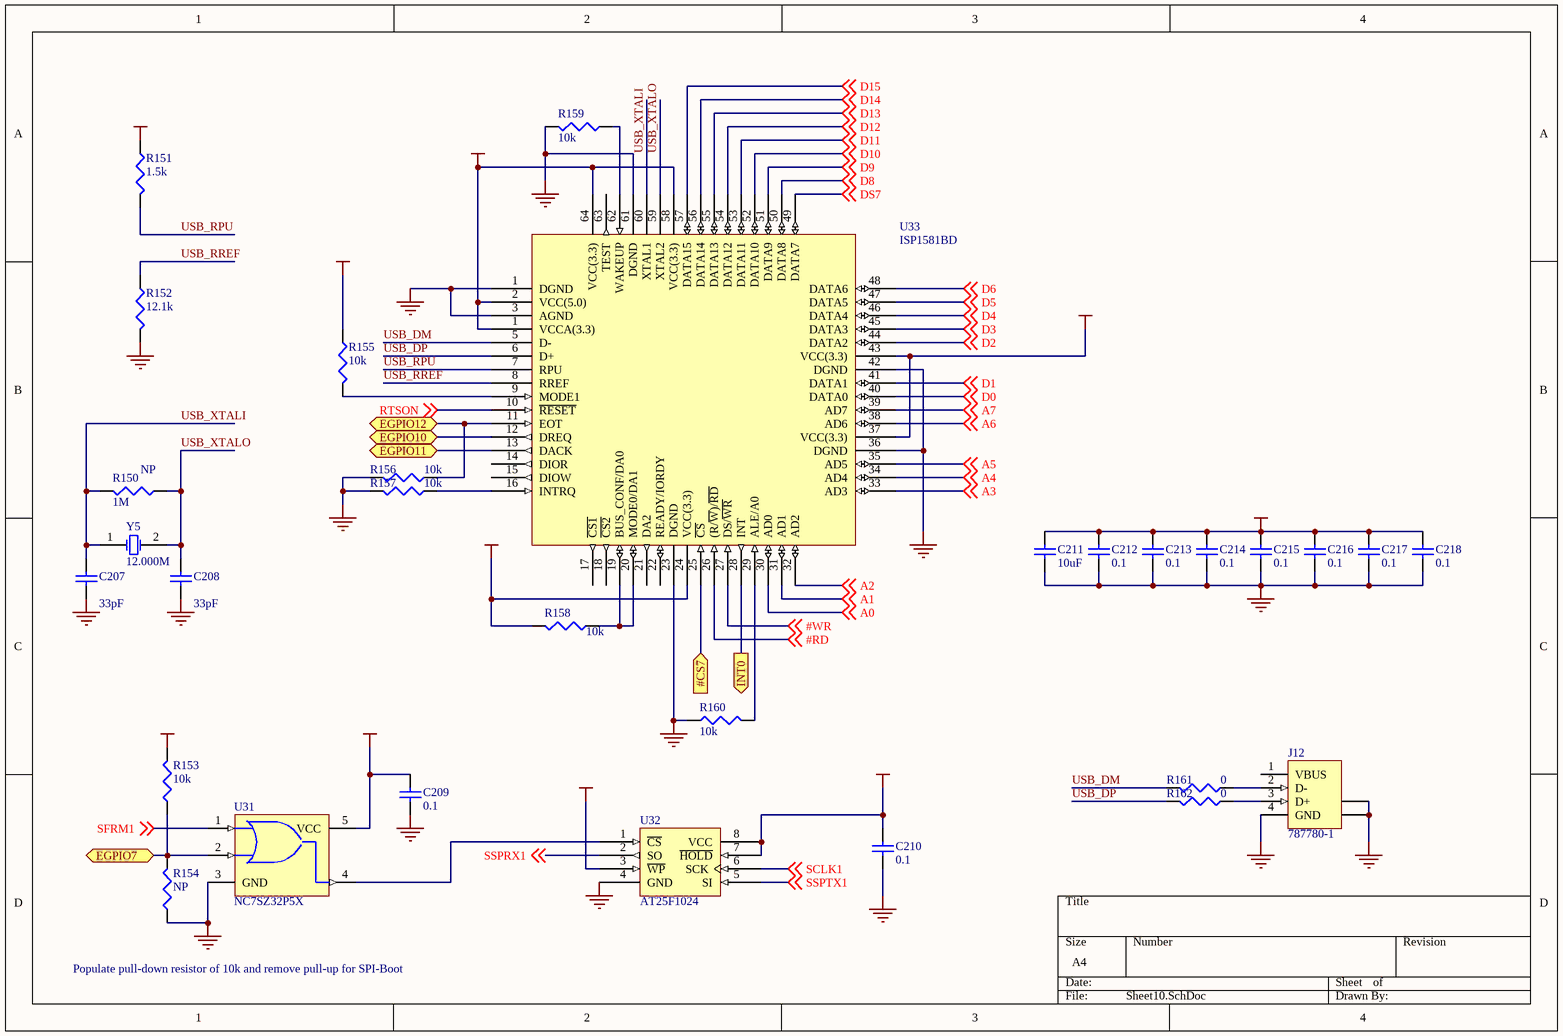
[diagram p9: Sheet10.SchDoc]

### Parts
C207  33pF  [0603]
C208  33pF  [0603]
C209  0.1  [0603]
C210  0.1  [0603]
C211  10uF  [1206]
C212  0.1  [0603]
C213  0.1  [0603]
C214  0.1  [0603]
C215  0.1  [0603]
C216  0.1  [0603]
C217  0.1  [0603]
C218  0.1  [0603]
J12  787780-1  [787780]
R150  NP  value 1M  [CR1608-0603]
R151  1.5k  [CR1608-0603]
R152  12.1k  [CR1608-0603]
R153  10k  [CR1608-0603]
R154  NP  [CR1608-0603]
R155  10k  [CR1608-0603]
R156  10k  [CR1608-0603]
R157  10k  [CR1608-0603]
R158  10k  [CR1608-0603]
R159  10k  [CR1608-0603]
R160  10k  [CR1608-0603]
R161  0  [CR1608-0603]
R162  0  [CR1608-0603]
U31  NC7SZ32P5X  [SC88A]
U32  AT25F1024  [M08A]
U33  ISP1581BD  [LQFP64]
Y5  12.000M  [CSM-7]

### Ports
#CS7 (in), EGPIO7 (bidir), EGPIO10 (bidir), EGPIO11 (bidir), EGPIO12 (bidir), INT0 (out)

### Nets
GND: C207.1 C208.1 C209.2 C210.2 C211.1 C212.2 C213.2 C214.2 C215.2 C216.2 C217.2 C218.2 J12.4(GND) J12.5(SHLD) J12.6(SHLD) R152.2 R154.1 R156.2 R157.2 R159.2 R160.1 U31.3(GND) U32.4(GND) U33.1(DGND) U33.3(AGND) U33.23(DGND) U33.36(DGND) U33.42(DGND) U33.61(DGND)
VCCIO: C209.1 C210.1 C211.2 C212.1 C213.1 C214.1 C215.1 C216.1 C217.1 C218.1 R151.1 R153.2 R155.1 R158.2 U31.5(VCC) U32.3(~{WP}) U32.7(~{HOLD}) U32.8(VCC) U33.1(VCCA(3.3)) U33.2(VCC(5.0)) U33.24(VCC(3.3)) U33.37(VCC(3.3)) U33.43(VCC(3.3)) U33.58(VCC(3.3)) U33.64(VCC(3.3))
#CS7: U33.25(~{CS}) ; port #CS7
#RD: U33.26((R/~{W})/~{RD}) ; off-sheet #RD
#WR: U33.27(DS/~{WR}) ; off-sheet #WR
A0: U33.30(AD0) ; off-sheet A0
A1: U33.31(AD1) ; off-sheet A1
A2: U33.32(AD2) ; off-sheet A2
A3: U33.33(AD3) ; off-sheet A3
A4: U33.34(AD4) ; off-sheet A4
A5: U33.35(AD5) ; off-sheet A5
A6: U33.38(AD6) ; off-sheet A6
A7: U33.39(AD7) ; off-sheet A7
D0: U33.40(DATA0) ; off-sheet D0
D1: U33.41(DATA1) ; off-sheet D1
D2: U33.44(DATA2) ; off-sheet D2
D3: U33.45(DATA3) ; off-sheet D3
D4: U33.46(DATA4) ; off-sheet D4
D5: U33.47(DATA5) ; off-sheet D5
D6: U33.48(DATA6) ; off-sheet D6
D8: U33.50(DATA8) ; off-sheet D8
D9: U33.51(DATA9) ; off-sheet D9
D10: U33.52(DATA10) ; off-sheet D10
D11: U33.53(DATA11) ; off-sheet D11
D12: U33.54(DATA12) ; off-sheet D12
D13: U33.55(DATA13) ; off-sheet D13
D14: U33.56(DATA14) ; off-sheet D14
D15: U33.57(DATA15) ; off-sheet D15
DS7: U33.49(DATA7) ; off-sheet DS7
INT0: U33.28(INT) ; port INT0
RTSON: U33.10(~{RESET}) ; off-sheet RTSON
SCLK1: U32.6(SCK) ; off-sheet SCLK1
SFRM1: U31.1(A) ; off-sheet SFRM1
SSPRX1: U32.2(SO) ; off-sheet SSPRX1  [project net SD_DO]
SSPTX1: U32.5(SI) ; off-sheet SSPTX1  [project net SD_DI]
USB_DM: R161.2 U33.5(D-)
USB_DP: R162.2 U33.6(D+)
USB_RPU: R151.2 U33.7(RPU)
USB_RREF: R152.1 U33.8(RREF)
USB_XTALI: C207.2 R150.2 U33.60(XTAL1) Y5.1(OSC1)
USB_XTALO: C208.2 R150.1 U33.59(XTAL2) Y5.2(OSC2)
NetJ12_2: J12.2(D-) R161.1
NetJ12_3: J12.3(D+) R162.1
NetR153_1: R153.1 R154.2 U31.2(B) ; port EGPIO7
NetR155_2: R155.2 U33.9(MODE1)
NetR156_1: R156.1 U33.11(EOT) ; port EGPIO12
NetR157_1: R157.1 U33.16(INTRQ)
NetR158_1: R158.1 U33.19(BUS_CONF/DA0) U33.20(MODE0/DA1)
NetR159_1: R159.1 U33.62(WAKEUP)
NetR160_2: R160.2 U33.29(ALE/A0)
NetU2_G19: U33.12(DREQ) ; port EGPIO10
NetU2_G20: U33.13(DACK) ; port EGPIO11
NetU31_4: U31.4(Y) U32.1(~{CS})

Not connected (* = marked no-connect by the designer): J12 1(VBUS); U33 14(DIOR) 15(DIOW) 17(~{CS1}) 18(~{CS2}) 21(DA2) 22(READY/IORDY) 63(TEST)

### Notes on the sheet
- Populate pull-down resistor of 10k and remove pull-up for SPI-Boot

### Library data of the parts
C207-C210 C212-C218 = C0603: as C185-C192 on sheet Sheet9; Published: 17-Jul-2002; LatestRevisionDate: 19-Mar-2004; LatestRevisionNote: Silkscreen size reduced.; DatasheetDocument: Mar-2001; PackageDocument: Mar-2001; PackageReference: 0603; Publisher: Altium Limited; Code_JEITA: 0603; Code_IPC: 1608 [0603]; ComponentLink1Description: Manufacturer Link; ComponentLink1URL: http://www.kemet.com/; ComponentLink2Description: Datasheet; ComponentLink2URL: http://www.kemet.com/kemet/web/homepage/kechome.nsf/vapubfilesname/F3102TA.pdf/$file/F3102TA.pdf
  C207 C208: Value: 33pF
  C209 C210 C212-C218: Value: 0.1
C211 = C1206: Ceramic Chip Capacitor - Standard; Published: 17-Jul-2002; LatestRevisionDate: 19-Mar-2004; LatestRevisionNote: Silkscreen size reduced.; DatasheetDocument: Mar-2001; PackageDocument: Mar-2001; PackageReference: 1206; Publisher: Altium Limited; Code_JEITA: 1206; Code_IPC: 3216 [1206]; ComponentLink1Description: Manufacturer Link; ComponentLink1URL: http://www.kemet.com/; ComponentLink2Description: Datasheet; ComponentLink2URL: http://www.kemet.com/kemet/web/homepage/kechome.nsf/vapubfilesname/F3102TA.pdf/$file/F3102TA.pdf; Value: 10uF
J12 = 787780-1: USB 1.1, Right Angle, Thru-Hole, B Type, Receptacle, 4 Position, Black; ContactMaterial: Copper Alloy; ContactPlating: Gold Flash over Palladium Nickel or Gold (30) over Nickel; TerminationLength: 3.00mm [0.118in.]; PCB_Layout: Complies with manufacturer's recommendation.; DrillSize: Corresponds to nominal value.; PanelGround: Without; Published: 15-Jul-2004; DatasheetDocument: 11-Jan-2004; PackageDocument: 11-Jan-2004; PackageReference: 787780; Publisher: Altium Limited; ComponentLink1Description: Manufacturer Link; ComponentLink1URL: http://www.tycoelectronics.com/; HousingMaterial: Thermoplastic
R150-R162 = Res3: Resistor; Published: 8-Jun-2000; Revision: July-2002: Re-released for DXP Platform.; Publisher: Altium Limited
  R151: Value: 1.5k
  R152: Value: 12.1k
  R153 R155-R160: Value: 10k
  R154: Value: NP
  R161 R162: Value: 0
U31 = NC7SZ32P5X: TinyLogic UHS 2-Input OR Gate
U32 = AT25F1024: 1Mbit High Speed SPI Serial Flash Memory
U33 = ISP1581BD: Hi-Speed Universal Serial Bus peripheral controller
Y5 = ECS-110-S-5P: Crystal Oscillator; Published: 17-Jul-2002; Datasheet: Latest Revision: 18-Apr-2000; Package Reference: CSM-7; Publisher: Altium Limited

## Sheet Sheet11.SchDoc
size A4
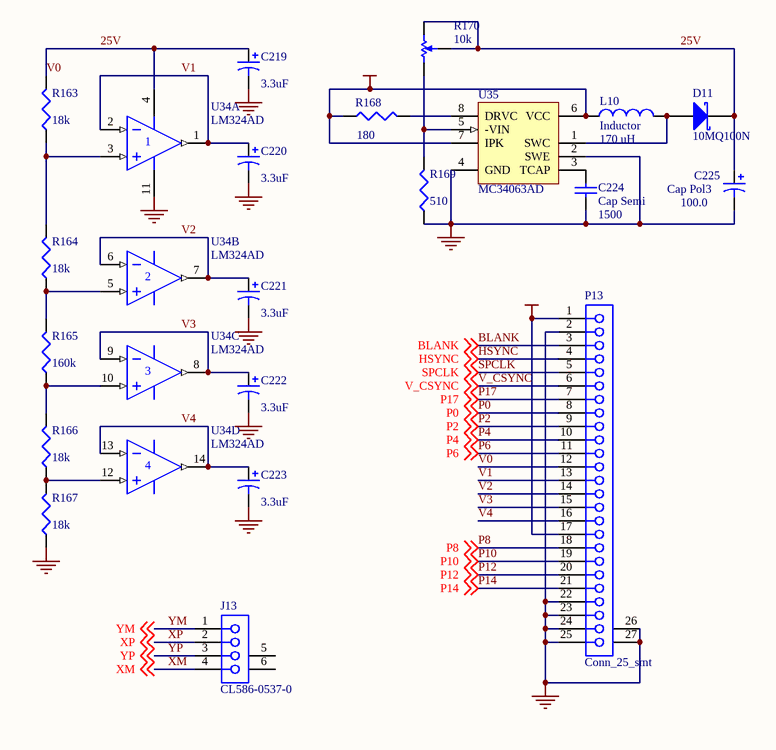
[diagram p10: Sheet11.SchDoc]

### Parts
C219  value 3.3uF  [CC2012-0805]  (hidden comment: Cap Pol3)
C220  value 3.3uF  [CC2012-0805]  (hidden comment: Cap Pol3)
C221  value 3.3uF  [CC2012-0805]  (hidden comment: Cap Pol3)
C222  value 3.3uF  [CC2012-0805]  (hidden comment: Cap Pol3)
C223  value 3.3uF  [CC2012-0805]  (hidden comment: Cap Pol3)
C224  Cap Semi  value 1500  [CC1608-0603]
C225  Cap Pol3  value 100.0  [CC5664-2225]
D11  10MQ100N  [CD4532-1812]
J13  CL586-0537-0  [FH12-10(4)SA-1SH]
L10  Inductor  value 170 uH  [INDC4532-1812]
P13  Conn_25_smt  [Conn_25_smt]
R163  value 18k  [CR1608-0603]  (hidden comment: Res3)
R164  value 18k  [CR1608-0603]  (hidden comment: Res3)
R165  value 160k  [CR1608-0603]  (hidden comment: Res3)
R166  value 18k  [CR1608-0603]  (hidden comment: Res3)
R167  value 18k  [CR1608-0603]  (hidden comment: Res3)
R168  value 180  [CR1608-0603]  (hidden comment: Res3)
R169  value 510  [CR1608-0603]  (hidden comment: Res3)
R170  10k  [POT4MM-2]
U34  LM324AD  [751A-02]  (parts A,B,C,D of 4)
U35  MC34063AD  [751-02]

### Nets
GND: C219.2 C220.2 C221.2 C222.2 C223.2 C224.1 C225.2 P13.2 P13.22 P13.23 P13.24 P13.25 P13.26(MH1) P13.27(MH2) R167.1 R169.1 U34.11(V-) U35.2(SWE) U35.4(GND)
VCC12: L10.1 R168.1 U35.6(VCC) U35.7(IPK)
VCCIO: P13.1 P13.17
25V: C219.1 C225.1 D11.2(K) P13.12 R163.2 R170.CW(+) R170.W U34.4(V+)  [also labelled V0]
BLANK: P13.3 ; off-sheet BLANK
HSYNC: P13.4 ; off-sheet HSYNC
P0: P13.8 ; off-sheet P0
P2: P13.9 ; off-sheet P2
P4: P13.10 ; off-sheet P4
P6: P13.11 ; off-sheet P6
P8: P13.18 ; off-sheet P8
P10: P13.19 ; off-sheet P10
P12: P13.20 ; off-sheet P12
P14: P13.21 ; off-sheet P14
P17: P13.7 ; off-sheet P17
SPCLK: P13.5 ; off-sheet SPCLK
V1: C220.1 P13.13 U34.1(OUT) U34.2(IN-)
V2: C221.1 P13.14 U34.6(IN-) U34.7(OUT)
V3: C222.1 P13.15 U34.8(OUT) U34.9(IN-)
V4: C223.1 P13.16 U34.13(IN-) U34.14(OUT)
V_CSYNC: P13.6 ; off-sheet V_CSYNC
XM: J13.4 ; off-sheet XM
XP: J13.2 ; off-sheet XP
YM: J13.1 ; off-sheet YM
YP: J13.3 ; off-sheet YP
NetC224_2: C224.2 U35.3(TCAP)
NetD11_1: D11.1(A) L10.2 U35.1(SWC)
NetR163_1: R163.1 R164.2 U34.3(IN+)
NetR164_1: R164.1 R165.2 U34.5(IN+)
NetR165_1: R165.1 R166.2 U34.10(IN+)
NetR166_1: R166.1 R167.2 U34.12(IN+)
NetR168_2: R168.2 U35.8(DRVC)
NetR169_2: R169.2 R170.CCW(-) U35.5(-VIN)

Not connected (* = marked no-connect by the designer): J13 5(MH1) 6(MH2)

### Library data of the parts
C219-C223 C225 = Cap Pol3: Polarized Capacitor (Surface Mount); Published: 8-Jun-2000; LatestRevisionDate: 17-Jul-2002; LatestRevisionNote: Re-released for DXP Platform.; PackageReference: C0805; Publisher: Altium Limited
C224 = Cap Semi: Capacitor (Semiconductor SIM Model); Published: 8-Jun-2000; LatestRevisionDate: 17-Jul-2002; LatestRevisionNote: Re-released for DXP Platform.; PackageReference: C1206; Publisher: Altium Limited
D11 = D Schottky: Schottky Diode; Published: 8-Jun-2000; LatestRevisionDate: 17-Jul-2002; LatestRevisionNote: Re-released for DXP Platform.; Publisher: Altium Limited; Code_JEDEC: DO-214-AA
J13 = CL586-0537-0: FH12 Series, "Flip-Lock" SMT/ZIF Connector - 1.0mm Spaced Bottom Eccentric Contact; Positions: 4; ContactMaterial: Phosphor Bronze; Current: 0.5A; PCB_Layout: Complies with manufacturer's recommendation.; Note: Pad dimensions follow nominal values, Suitable for Wave Soldering, Adjust for Re-flow.; Published: 17-Jul-2002; DatasheetDocument: 13-Nov-2000; PackageDocument: 13-Nov-2000; PackageReference: FH12-10(4)SA-1SH; Publisher: Altium Limited; ComponentLink1Description: Manufacturer Link; ComponentLink1URL: http://www.hiroseusa.com/; ComponentLink2Description: Datasheet; ComponentLink2URL: http://www.hirose.co.jp/cataloge_hp/e58605370.pdf
L10 = Inductor: Code_IEC: 1005; Published: 8-Jun-2000; LatestRevisionDate: 17-Jul-2002; LatestRevisionNote: Re-released for DXP Platform.; PackageReference: 0402-A; Publisher: Altium Limited; Code_JEITA: 0402
R163-R169 = Res3: Resistor; Published: 8-Jun-2000; LatestRevisionDate: 17-Jul-2002; LatestRevisionNote: Re-released for DXP Platform.; Publisher: Altium Limited
R170 = RPot SM: Square Trimming Potentiometer; Published: 17-Dec-2003; DatasheetDocument: Oct-2003; Publisher: Altium Limited
U34 = LM324AD: Quad Low-Power Operational Amplifier; PackageDocument: 1991; Published: 17-Jul-2002; LatestRevisionDate: 6-Jun-2005; LatestRevisionNote: Stylized 3D Model Added.; DatasheetDocument: 1988; PackageReference: 751A-02; Publisher: Altium Limited; ComponentLink1Description: Manufacturer Link; ComponentLink1URL: http://www.motorola.com/
U35 = MC34063AD: DC-to-DC Converter Control Circuit; Published: 17-Jul-2002; LatestRevisionDate: 6-Jun-2005; LatestRevisionNote: Stylized 3D Model Added.; DatasheetDocument: 1988; PackageReference: 751-02; Publisher: Altium Limited; Code_JEDEC: MS-012-AA; Code_IPC: SO8; ComponentLink1Description: Manufacturer Link; ComponentLink1URL: http://www.motorola.com/

## Nets that join several sheets
GND: Sheet1 (23 pins), Sheet2 (P2.5 P2.9 P3.5 P3.15), Sheet3 (133 pins), Sheet4 (48 pins), Sheet5 (65 pins), Sheet6 (28 pins), Sheet7 (25 pins), Sheet8 (46 pins), Sheet9 (88 pins), Sheet10 (29 pins), Sheet11 (19 pins)
VCC5V0: Sheet1 (C4.2 U3.20), Sheet3 (12 pins), Sheet4 (6 pins), Sheet7 (R94.2), Sheet8 (C173.1 L6.2), Sheet9 (C190.1 C193.2 L8.1)
VCC12: Sheet3 (14 pins), Sheet8 (C151.1 U23.8), Sheet11 (L10.1 R168.1 U35.6 U35.7)
VCCCORE: Sheet3 (39 pins), Sheet5 (C127#1.2 C129#1.2 U18.13 U18.33), Sheet7 (R63.2 R99.2)
VCCIO: Sheet1 (12 pins), Sheet2 (P2.2 P3.10 P3.20), Sheet3 (46 pins), Sheet4 (21 pins), Sheet5 (61 pins), Sheet6 (13 pins), Sheet7 (15 pins), Sheet8 (C146.2 R106.2 U22.10), Sheet9 (21 pins), Sheet10 (25 pins), Sheet11 (P13.1 P13.17)
#CAS: Sheet1 (U2.H2), Sheet5 (U14.17 U15.17 U16.17 U17.17)
#CS6: Sheet1 (R18.1 U2.E4), Sheet5 (U18.30)
#CS7: Sheet1 (R20.1 U2.A1), Sheet10 (U33.25)
#DQM0: Sheet1 (U2.J2), Sheet5 (U16.39)
#DQM1: Sheet1 (U2.J3), Sheet5 (U14.39)
#DQM2: Sheet1 (U2.J4), Sheet5 (U17.39)
#DQM3: Sheet1 (U2.H1), Sheet5 (U15.39)
#POR: Sheet1 (R24.1 U2.L20), Sheet7 (U20.7)
#RAS: Sheet1 (U2.H3), Sheet5 (U14.18 U15.18 U16.18 U17.18)
#RD: Sheet1 (U2.A7), Sheet5 (U18.32), Sheet10 (U33.26)
#SDCS0: Sheet1 (U2.G1), Sheet5 (U14.19 U15.19 U16.19 U17.19)
#SDWE: Sheet1 (U2.G3), Sheet5 (U14.16 U15.16 U16.16 U17.16)
#WR: Sheet1 (U2.B7), Sheet5 (U18.14), Sheet10 (U33.27)
A0: Sheet1 (R171.1 U2.U1), Sheet5 (U14.23 U15.23 U16.23 U17.23), Sheet10 (U33.30)
A1: Sheet1 (R171.2 U2.R2), Sheet5 (U14.24 U15.24 U16.24 U17.24), Sheet10 (U33.31)
A2: Sheet1 (R171.3 U2.R1), Sheet5 (U14.25 U15.25 U16.25 U17.25), Sheet10 (U33.32)
A3: Sheet1 (R171.4 U2.N4), Sheet5 (U14.26 U15.26 U16.26 U17.26), Sheet10 (U33.33)
A4: Sheet1 (R172.1 U2.P1), Sheet5 (U14.29 U15.29 U16.29 U17.29), Sheet10 (U33.34)
A5: Sheet1 (R172.2 U2.M4), Sheet5 (U14.30 U15.30 U16.30 U17.30), Sheet10 (U33.35)
A6: Sheet1 (R172.3 U2.M3), Sheet5 (U14.31 U15.31 U16.31 U17.31), Sheet10 (U33.38)
A7: Sheet1 (R172.4 U2.M1), Sheet5 (U14.32 U15.32 U16.32 U17.32), Sheet10 (U33.39)
A8: Sheet1 (R173.1 U2.Y10), Sheet5 (U14.33 U15.33 U16.33 U17.33)
A9: Sheet1 (R173.2 U2.W9), Sheet5 (U14.34 U15.34 U16.34 U17.34)
A10: Sheet1 (R173.3 U2.Y8), Sheet5 (U14.22 U15.22 U16.22 U17.22)
A11: Sheet1 (R173.4 U2.W8), Sheet5 (U14.35 U15.35 U16.35 U17.35)
A12: Sheet1 (R177.1 U2.V8), Sheet5 (U14.36 U15.36 U16.36 U17.36)
A14: Sheet1 (R177.3 U2.V7), Sheet5 (U14.20 U15.20 U16.20 U17.20)
A15: Sheet1 (R177.4 U2.Y5), Sheet5 (U14.21 U15.21 U16.21 U17.21)
AA1: Sheet1 (R171.7), Sheet5 (U18.29)
AA2: Sheet1 (R171.6), Sheet5 (U18.25)
AA3: Sheet1 (R171.5), Sheet5 (U18.24)
AA4: Sheet1 (R172.8), Sheet5 (U18.23)
AA5: Sheet1 (R172.7), Sheet5 (U18.22)
AA6: Sheet1 (R172.6), Sheet5 (U18.21)
AA7: Sheet1 (R172.5), Sheet5 (U18.20)
AA8: Sheet1 (R173.8), Sheet5 (U18.19)
AA9: Sheet1 (R173.7), Sheet5 (U18.8)
AA10: Sheet1 (R173.6), Sheet5 (U18.7)
AA11: Sheet1 (R173.5), Sheet5 (U18.6)
AA12: Sheet1 (R177.8), Sheet5 (U18.5)
AA13: Sheet1 (R177.7), Sheet5 (U18.4)
AA14: Sheet1 (R177.6), Sheet5 (U18.3)
AA15: Sheet1 (R177.5), Sheet5 (U18.2)
AA16: Sheet1 (R180.5), Sheet5 (U18.1)
AA17: Sheet1 (R180.6), Sheet5 (U18.55)
AA18: Sheet1 (R179.7), Sheet5 (U18.18)
AA19: Sheet1 (R179.6), Sheet5 (U18.17)
AA20: Sheet1 (R179.5), Sheet5 (U18.16)
AA21: Sheet1 (R178.6), Sheet5 (U18.11)
AA22: Sheet1 (R178.8), Sheet5 (U18.10)
AA23: Sheet1 (R178.7), Sheet5 (U18.9)
AA24: Sheet1 (R179.8), Sheet5 (U18.26)
AA25: Sheet1 (R178.5), Sheet5 (U18.27)
BLANK: Sheet2 (U2.T2), Sheet9 (R141.1 S2.1 U30.11), Sheet11 (P13.3)
BOOT0: Sheet1 (U2.U12), Sheet7 (R73.2 SW1.1 SW1.4)
BRIGHT: Sheet2 (U2.P4), Sheet3 (C59.2 R27.1 R29.2 R30.2)
D0: Sheet1 (U2.U10), Sheet5 (R184.8), Sheet10 (U33.40)
D1: Sheet1 (U2.Y9), Sheet5 (R184.7), Sheet10 (U33.41)
D2: Sheet1 (U2.V9), Sheet5 (R184.6), Sheet10 (U33.44)
D3: Sheet1 (U2.U9), Sheet5 (R184.5), Sheet10 (U33.45)
D4: Sheet1 (U2.Y7), Sheet5 (R185.8), Sheet10 (U33.46)
D5: Sheet1 (U2.W7), Sheet5 (R185.7), Sheet10 (U33.47)
D6: Sheet1 (U2.Y6), Sheet5 (R185.6), Sheet10 (U33.48)
D7: Sheet1 (U2.W6), Sheet5 (R185.5)
D8: Sheet1 (U2.T1), Sheet5 (R186.8), Sheet10 (U33.50)
D9: Sheet1 (U2.P3), Sheet5 (R186.7), Sheet10 (U33.51)
D10: Sheet1 (U2.P2), Sheet5 (R186.6), Sheet10 (U33.52)
D11: Sheet1 (U2.N3), Sheet5 (R186.5), Sheet10 (U33.53)
D12: Sheet1 (U2.N2), Sheet5 (R187.8), Sheet10 (U33.54)
D13: Sheet1 (U2.N1), Sheet5 (R187.7), Sheet10 (U33.55)
D14: Sheet1 (U2.M2), Sheet5 (R187.6), Sheet10 (U33.56)
D15: Sheet1 (U2.L4), Sheet5 (R187.5), Sheet10 (U33.57)
D16: Sheet1 (U2.L3), Sheet5 (R174.8)
D17: Sheet1 (U2.L2), Sheet5 (R174.6)
D18: Sheet1 (U2.L1), Sheet5 (R174.7)
D19: Sheet1 (U2.K4), Sheet5 (R174.5)
D20: Sheet1 (U2.K2), Sheet5 (R181.8)
D21: Sheet1 (U2.J1), Sheet5 (R181.7)
D22: Sheet1 (U2.F2), Sheet5 (R181.6)
D23: Sheet1 (U2.E2), Sheet5 (R182.8)
D24: Sheet1 (U2.F3), Sheet5 (R181.5)
D25: Sheet1 (U2.D2), Sheet5 (R182.6)
D26: Sheet1 (U2.E3), Sheet5 (R182.7)
D27: Sheet1 (U2.B4), Sheet5 (R182.5)
D28: Sheet1 (U2.A2), Sheet5 (R183.5)
D29: Sheet1 (U2.C4), Sheet5 (R183.6)
D30: Sheet1 (U2.B3), Sheet5 (R183.7)
D31: Sheet1 (U2.B2), Sheet5 (R183.8)
DS7: Sheet5 (U18.53), Sheet10 (U33.49)
EECLK: Sheet1 (R15.1), Sheet2 (P2.1), Sheet4 (U2.W14)
EEDAT: Sheet1 (R16.1), Sheet2 (P2.3), Sheet4 (U2.Y15)
EGPIO0: Sheet2 (U2.E18), Sheet4 (R35.2 U8.7)
HSYNC: Sheet2 (U2.Y1), Sheet9 (J14.4 U28.22 U29.1), Sheet11 (P13.4)
INT0: Sheet1 (R8.2 U2.T15), Sheet10 (U33.28)
INT3: Sheet1 (R11.2 U2.W17), Sheet7 (R71.1)
MCLD: Sheet4 (U2.A13), Sheet6 (U19.1)
MCRS: Sheet4 (U2.B12), Sheet6 (U19.23)
MDC: Sheet4 (U2.C8), Sheet6 (U19.25)
MDIO: Sheet4 (U2.B8), Sheet6 (U19.26)
MRXCLK: Sheet4 (U2.A8), Sheet6 (U19.16)
MRXD0: Sheet4 (U2.A9), Sheet6 (U19.21)
MRXD1: Sheet4 (U2.B9), Sheet6 (U19.20)
MRXD2: Sheet4 (U2.D9), Sheet6 (U19.19)
MRXD3: Sheet4 (U2.C9), Sheet6 (U19.18)
MRXERR: Sheet4 (U2.B10), Sheet6 (U19.24)
MRXVAL: Sheet4 (U2.A10), Sheet6 (U19.22)
MTXCLK: Sheet4 (U2.C10), Sheet6 (U19.7)
MTXD0: Sheet4 (U2.C11), Sheet6 (U19.6)
MTXD1: Sheet4 (U2.B11), Sheet6 (U19.5)
MTXD2: Sheet4 (U2.A11), Sheet6 (U19.4)
MTXD3: Sheet4 (U2.D10), Sheet6 (U19.3)
MTXEN: Sheet4 (U2.D11), Sheet6 (U19.2)
NetR12_2: Sheet1 (R12.2 U3.7), Sheet2 (U2.E19)
NetR28_2: Sheet2 (U2.D20), Sheet3 (R28.2)
NetR66_1: Sheet2 (U2.F17), Sheet7 (R66.1)
NetR67_1: Sheet2 (U2.E17), Sheet7 (R67.1)
NetR68_1: Sheet2 (U2.D19), Sheet7 (R68.1)
NetR69_1: Sheet2 (U2.C19), Sheet7 (R69.1)
NetR70_1: Sheet2 (U2.C20), Sheet7 (R70.1)
NetR72_1: Sheet2 (U2.A18), Sheet7 (R72.1)
NetR74_1: Sheet2 (U2.B5), Sheet7 (R74.1)
NetR74_2: Sheet2 (U2.C6), Sheet7 (R74.2)
NetR74_3: Sheet2 (U2.D7), Sheet7 (R74.3)
NetR74_4: Sheet2 (U2.A5), Sheet7 (R74.4)
NetR75_1: Sheet2 (U2.B6), Sheet7 (R75.1)
NetR75_2: Sheet2 (U2.C7), Sheet7 (R75.2)
NetR75_3: Sheet2 (U2.Y2), Sheet7 (R75.3)
NetR75_4: Sheet2 (U2.W3), Sheet7 (R75.4)
NetR76_1: Sheet2 (U2.W11), Sheet7 (R76.1)
NetR76_2: Sheet2 (U2.Y11), Sheet7 (R76.2)
NetR76_3: Sheet2 (U2.V10), Sheet7 (R76.3)
NetR88_5: Sheet2 (U2.D3), Sheet7 (R88.5)
NetR88_6: Sheet2 (U2.C5), Sheet7 (R88.6)
NetR88_7: Sheet2 (U2.D6), Sheet7 (R88.7)
NetR88_8: Sheet2 (U2.A4), Sheet7 (R88.8)
NetR89_5: Sheet2 (U2.V4), Sheet7 (R89.5)
NetR89_6: Sheet2 (U2.T6), Sheet7 (R89.6)
NetR89_7: Sheet2 (U2.V5), Sheet7 (R89.7)
NetR89_8: Sheet2 (U2.Y3), Sheet7 (R89.8)
NetR90_1: Sheet2 (U2.V11), Sheet7 (R90.1)
NetR90_2: Sheet2 (U2.W10), Sheet7 (R90.2)
NetR91_2: Sheet2 (U2.G18), Sheet7 (R91.2)
NetR92_2: Sheet2 (U2.F20), Sheet7 (R92.2)
NetR102_2: Sheet2 (U2.D15), Sheet8 (R102.2 U22.14)
NetR103_2: Sheet2 (U2.E16), Sheet8 (R103.2 U22.6)
NetR106_1: Sheet2 (U2.F19), Sheet8 (R106.1 U22.13)
NetR153_1: Sheet2 (U2.G17), Sheet10 (R153.1 R154.2 U31.2)
NetR156_1: Sheet2 (U2.A17), Sheet10 (R156.1 U33.11)
NetU2_D18: Sheet2 (U2.D18), Sheet8 (U22.3)
NetU2_G19: Sheet2 (U2.G19), Sheet10 (U33.12)
NetU2_G20: Sheet2 (U2.G20), Sheet10 (U33.13)
NetU2_V14: Sheet2 (U2.V14), Sheet8 (U22.4)
NetU2_Y20: Sheet2 (U2.Y20), Sheet8 (U22.5)
P0: Sheet2 (U2.U7), Sheet9 (J14.29 U28.13 U30.18), Sheet11 (P13.8)
P1: Sheet2 (U2.V6), Sheet9 (J14.30 U28.15 U30.19)
P2: Sheet2 (U2.Y4), Sheet9 (J14.31 U28.16 U30.20), Sheet11 (P13.9)
P3: Sheet2 (U2.W5), Sheet9 (J14.33 U28.18 U30.21)
P4: Sheet2 (U2.U6), Sheet9 (J14.34 U28.19 U30.16 U30.22), Sheet11 (P13.10)
P5: Sheet2 (U2.W4), Sheet9 (J14.35 U28.20 U30.17 U30.23)
P6: Sheet2 (U2.U5), Sheet9 (J14.19 U28.4 U30.5), Sheet11 (P13.11)
P7: Sheet2 (U2.U4), Sheet9 (J14.20 U28.6 U30.6)
P8: Sheet2 (U2.V3), Sheet9 (J14.21 U28.7 U30.7), Sheet11 (P13.18)
P9: Sheet2 (U2.W2), Sheet9 (J14.23 U28.9 U30.8)
P10: Sheet2 (U2.U3), Sheet9 (J14.24 U28.10 U30.3 U30.9), Sheet11 (P13.19)
P11: Sheet2 (U2.V2), Sheet9 (J14.25 U28.12 U30.4 U30.10)
P12: Sheet2 (U2.W1), Sheet9 (J14.9 U28.44 U30.43), Sheet11 (P13.20)
P13: Sheet2 (U2.T3), Sheet9 (J14.10 U28.45 U30.44)
P14: Sheet2 (U2.R4), Sheet9 (J14.11 U28.47 U30.45), Sheet11 (P13.21)
P15: Sheet2 (U2.U2), Sheet9 (J14.13 U28.48 U30.46)
P16: Sheet2 (U2.V1), Sheet9 (J14.14 U28.1 U30.41 U30.47)
P17: Sheet2 (U2.R3), Sheet9 (J14.15 U28.3 U30.42 U30.48), Sheet11 (P13.7)
RDLED: Sheet1 (R6.2 U2.Y18), Sheet7 (R87.2)
RTC_CS: Sheet1 (R7.2 U3.12), Sheet2 (U2.B17)
RTSON: Sheet1 (R2.2 U1.6), Sheet4 (R40.2), Sheet5 (U18.44), Sheet6 (U19.42), Sheet7 (R82.2), Sheet10 (U33.10)
~{SD_CS}: Sheet2 (U2.F18), Sheet7 (P10.1 R93.2)
SCLK1: Sheet1 (U3.14), Sheet2 (P2.4 U2.W15), Sheet7 (P10.5), Sheet8 (U22.11), Sheet10 (U32.6)
SD_DI: Sheet1 (U3.15), Sheet2 (P2.6 U2.V15), Sheet7 (P10.2), Sheet8 (U22.12), Sheet10 (U32.5)
SD_DO: Sheet1 (U3.16), Sheet2 (P2.10 U2.U14), Sheet7 (P10.7), Sheet10 (U32.2)
SDCLK: Sheet1 (R5.2), Sheet5 (U14.38 U15.38 U16.38 U17.38)
SDCLKEN: Sheet1 (U2.D4), Sheet5 (U14.37 U15.37 U16.37 U17.37)
SDIN: Sheet1 (R19.1), Sheet2 (U2.Y16), Sheet8 (U22.7)
SFRM1: Sheet2 (P2.8 R25.1 U2.Y17), Sheet10 (U31.1)
SPCLK: Sheet2 (U2.T4), Sheet9 (J14.2 R149.1 U28.26), Sheet11 (P13.5)
V_CSYNC: Sheet2 (U2.T5), Sheet9 (J14.5 U28.23 U29.3), Sheet11 (P13.6)
XM: Sheet2 (U2.J18), Sheet9 (J11.1), Sheet11 (J13.4)
XP: Sheet2 (U2.H20), Sheet9 (J11.3), Sheet11 (J13.2)
YM: Sheet2 (U2.J20), Sheet9 (J11.4), Sheet11 (J13.1)
YP: Sheet2 (U2.J19), Sheet9 (J11.2), Sheet11 (J13.3)